# EAGLE schematic Four Channel Relay Driver (EAGLE 6.1)
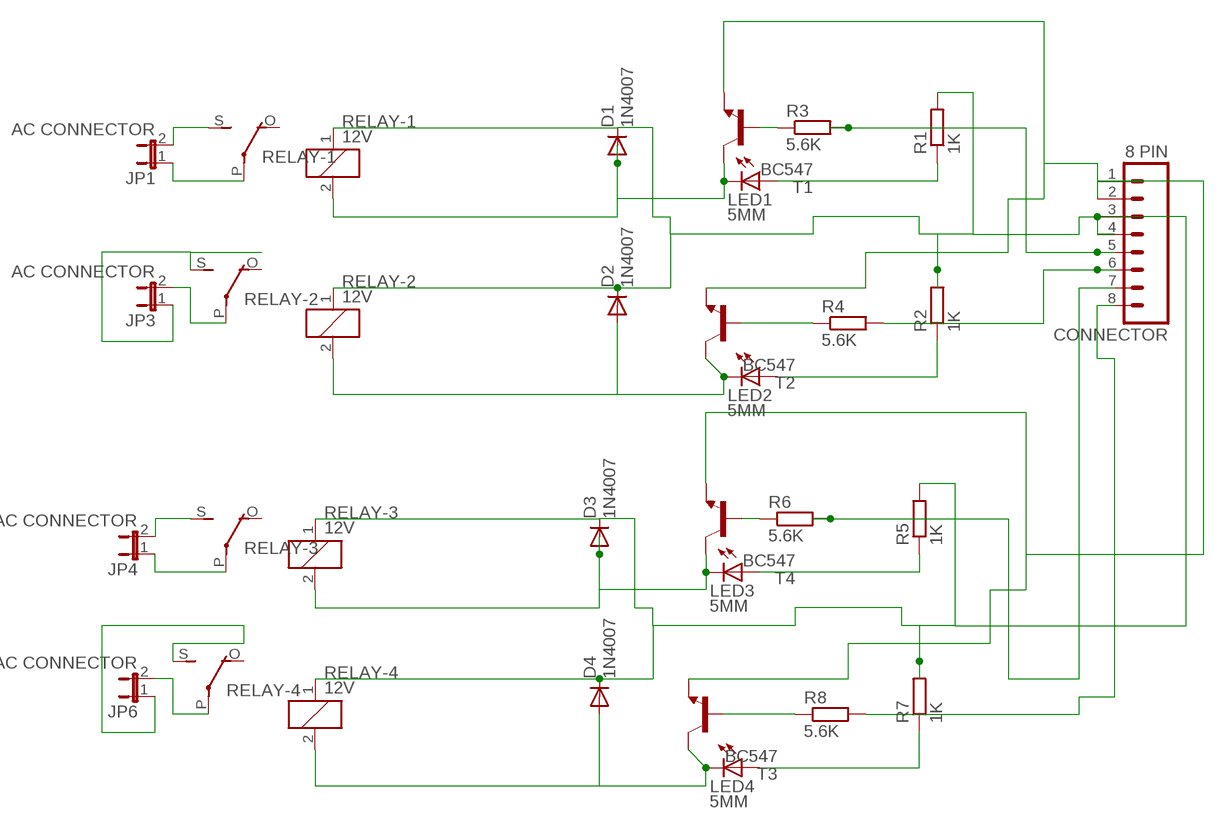
[diagram p0: schematic, sheet 1]

## Parts
CONNECTOR  8 PIN  M08  [08P]
D1  1N4007  1N4004  [DO41-10]
D2  1N4007  1N4004  [DO41-10]
D3  1N4007  1N4004  [DO41-10]
D4  1N4007  1N4004  [DO41-10]
JP1  AC CONNECTOR  JP1E  [JP1]
JP3  AC CONNECTOR  JP1E  [JP1]
JP4  AC CONNECTOR  JP1E  [JP1]
JP6  AC CONNECTOR  JP1E  [JP1]
LED1  5MM  LED5MM  [LED5MM]
LED2  5MM  LED5MM  [LED5MM]
LED3  5MM  LED5MM  [LED5MM]
LED4  5MM  LED5MM  [LED5MM]
R1  1K  R-EU_0204/7  [0204/7]
R2  1K  R-EU_0204/7  [0204/7]
R3  5.6K  R-EU_0204/7  [0204/7]
R4  5.6K  R-EU_0204/7  [0204/7]
R5  1K  R-EU_0204/7  [0204/7]
R6  5.6K  R-EU_0204/7  [0204/7]
R7  1K  R-EU_0204/7  [0204/7]
R8  5.6K  R-EU_0204/7  [0204/7]
RELAY-1  12V  G5L  [G5LE]
RELAY-2  12V  G5L  [G5LE]
RELAY-3  12V  G5L  [G5LE]
RELAY-4  12V  G5L  [G5LE]
T1  BC547  [TO92]
T2  BC547  [TO92]
T3  BC547  [TO92]
T4  BC547  [TO92]

## Nets
N$1: D1.A LED1.K(C) RELAY-1.2 T1.3(C)
N$3: D3.A LED3.K(C) RELAY-3.2 T4.3(C)
N$4: CONNECTOR.3 CONNECTOR.4 D1.C D2.C D3.C D4.C R1.2 R2.2 R5.2 R7.2 RELAY-1.1 RELAY-2.1 RELAY-3.1 RELAY-4.1
N$5: R4.1 T2.2(B)
N$6: R3.1 T1.2(B)
N$7: LED1.A R1.1
N$8: LED2.A R2.1
N$9: JP1.2 RELAY-1.S(2:S)
N$10: JP1.1 RELAY-1.P(2:P)
N$12: JP3.1 RELAY-2.S(2:S)
N$13: JP3.2 RELAY-2.P(2:P)
N$15: R8.1 T3.2(B)
N$17: CONNECTOR.5 R3.2
N$18: CONNECTOR.6 R4.2
N$19: R6.1 T4.2(B)
N$20: D2.A LED2.K(C) RELAY-2.2 T2.3(C)
N$21: LED3.A R5.1
N$22: LED4.A R7.1
N$23: JP4.2 RELAY-3.S(2:S)
N$24: JP4.1 RELAY-3.P(2:P)
N$26: JP6.1 RELAY-4.S(2:S)
N$27: JP6.2 RELAY-4.P(2:P)
N$29: CONNECTOR.1 CONNECTOR.2 T1.1(E) T2.1(E) T3.1(E) T4.1(E)
N$30: CONNECTOR.7 R6.2
N$31: CONNECTOR.8 R8.2
N$32: D4.A LED4.K(C) RELAY-4.2 T3.3(C)
Unconnected: RELAY-1.O(2:O) RELAY-2.O(2:O) RELAY-3.O(2:O) RELAY-4.O(2:O)

## Library data of the parts
CONNECTOR = con-amp-quick:M08: AMP QUICK CONNECTOR; OC_FARNELL: unknown; OC_NEWARK: unknown
D1-D4 = diode:1N4004: DIODE general purpose rectifier, 1 A
JP1 JP3 JP4 JP6 = jumper:JP1E: JUMPER
LED1-LED4 = led:LED: LED OSRAM: - CHIPLED LG R971, LG N971, LY N971, LG Q971, LY Q971, LO R971, LY R971 LH N974, LH R974 LS Q976, LO Q976, LY Q976 LO Q996 - Hyper CHIPLED LW Q18S LB Q993, LB Q99A, LB R99A - SideLED LS A670, LO A670, LY A670, LG A670, LP A670 LB A673, LV A673, LT A673, LW A673 LH A674 LY A675 LS A676, LA A676, LO A676, LY A676, LW A676 LS A679, LY A679, LG A679 - Hyper Micro SIDELED® LS Y876, LA Y876, LO Y876, LY Y876 LT Y87S - SmartLED LW L88C, LW L88S LB L89C, LB L89S, LG L890 LS L89K, LO L89K, LY L89K LS L896, LA L896, LO L896, LY L896 - TOPLED LS T670, LO T670, LY T670, LG T670, LP T670 LSG T670, LSP T670, LSY T670, LOP T670, LYG T670 LG T671, LOG T671, LSG T671 LB T673, LV T673, LT T673, LW T673 LH T674 LS T676, LA T676, LO T676, LY T676, LB T676, LH T676, LSB T676, LW T676 LB T67C, LV T67C, LT T67C, LS T67K, LO T67K, LY T67K, LW E67C LS E67B, LA E67B, LO E67B, LY E67B, LB E67C, LV E67C, LT E67C LW T67C LS T679, LY T679, LG T679 LS T770, LO T770, LY T770, LG T770, LP T770 LB T773, LV T773, LT T773, LW T773 LH T774 LS E675, LA E675, LY E675, LS T675 LS T776, LA T776, LO T776, LY T776, LB T776 LHGB T686 LT T68C, LB T68C - Hyper Mini TOPLED® LB M676 - Mini TOPLED Santana® LG M470 LS M47K, LO M47K, LY M47K Source: http://www.osram.convergy.de LUXEON: - LUMILED® LXK2-PW12-R00, LXK2-PW12-S00, LXK2-PW14-U00, LXK2-PW14-V00 LXK2-PM12-R00, LXK2-PM12-S00, LXK2-PM14-U00 LXK2-PE12-Q00, LXK2-PE12-R00, LXK2-PE12-S00, LXK2-PE14-T00, LXK2-PE14-U00 LXK2-PB12-K00, LXK2-PB12-L00, LXK2-PB12-M00, LXK2-PB14-N00, LXK2-PB14-P00, LXK2-PB14-Q00 LXK2-PR12-L00, LXK2-PR12-M00, LXK2-PR14-Q00, LXK2-PR14-R00 LXK2-PD12-Q00, LXK2-PD12-R00, LXK2-PD12-S00 LXK2-PH12-R00, LXK2-PH12-S00 LXK2-PL12-P00, LXK2-PL12-Q00, LXK2-PL12-R00 Source: www.luxeon.com KINGBRIGHT: KA-3528ASYC Source: www.kingbright.com
R1-R8 = rcl:R-EU_: RESISTOR, European symbol
RELAY-1-RELAY-4 = relay:G5L: RELAY 1 x switch, 10 A/120 V AC, 8 A/30 V ADC, Omron; OC_FARNELL: unknown; OC_NEWARK: unknown
T1-T4 = transistor:BC547: NPN TRANSISTOR